# EAGLE design mugsyBrainBoard_p08 (EAGLE 9.6.2)
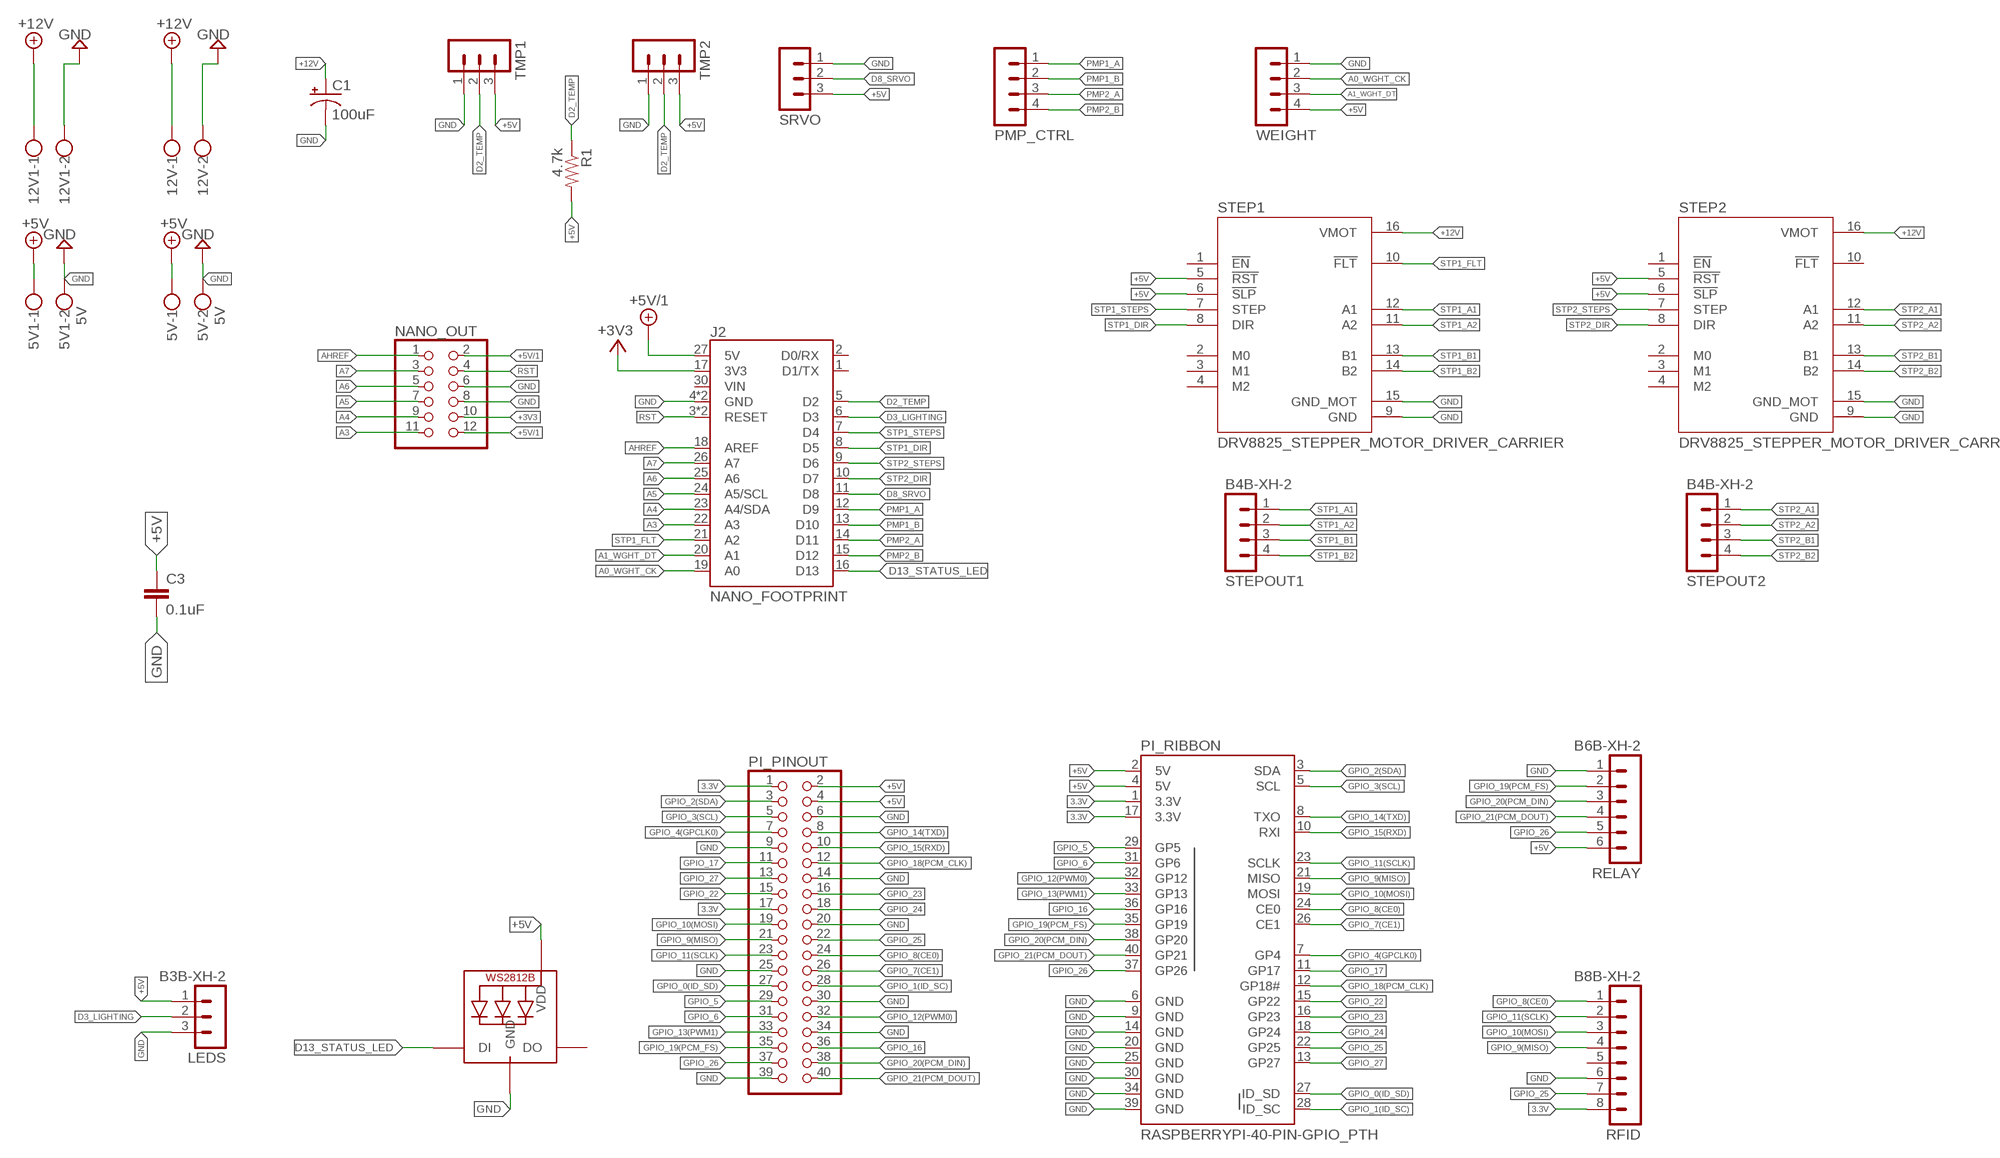
[diagram p0: schematic, sheet 1]

## Parts
5V  5V  W237-102  [W237-102]
5V1  5V  W237-102  [W237-102]
12V  W237-102  [W237-102]
12V1  W237-102  [W237-102]
C1  100uF  100UF-POLAR-RADIAL-2.5MM-25V-20%  [CPOL-RADIAL-2.5MM-6.5MM]
C3  0.1uF  C-EU050-030X075  [C050-030X075]
J2  NANO_FOOTPRINT  [NANO]
LEDS  B3B-XH-2  [B3B-XH-A]
NANO_OUT  PINHD-2X6  [2X06]
PI_PINOUT  PINHD-2X20  [2X20]
PI_RIBBON  RASPBERRYPI-40-PIN-GPIO_PTH  [2X20_SHROUDED]
PMP_CTRL  B4B-XH-2  [B4B-XH-A]
R1  4.7k  R-US_0207/5V  [0207/5V]
RELAY  B6B-XH-2  [B6B-XH-A]
RFID  B8B-XH-2  [B8B-XH-A]
SRVO  B3B-XH-2  [B3B-XH-A]
STATUS  WS2812B5050  [WS2812B]
STEP1  DRV8825_STEPPER_MOTOR_DRIVER_CARRIER  [IC_DRV8825_STEPPER_MOTOR_DRIVER_CARRIER]
STEP2  DRV8825_STEPPER_MOTOR_DRIVER_CARRIER  [IC_DRV8825_STEPPER_MOTOR_DRIVER_CARRIER]
STEPOUT1  B4B-XH-2  [B4B-XH-A]
STEPOUT2  B4B-XH-2  [B4B-XH-A]
TMP1  B3B-XH-2  [B3B-XH-A]
TMP2  B3B-XH-2  [B3B-XH-A]
WEIGHT  B4B-XH-2  [B4B-XH-A]

## Nets
3.3V [def2]: PI_PINOUT.1 PI_PINOUT.17 PI_RIBBON.1(3.3V) PI_RIBBON.17(3.3V) RFID.8
+3V3 [def2]: J2.17(3V3) NANO_OUT.10
+5V [5V]: 5V1.1 5V.1 C3.1 LEDS.1 PI_PINOUT.2 PI_PINOUT.4 PI_RIBBON.2(5V) PI_RIBBON.4(5V) R1.2 RELAY.6 SRVO.3 STATUS.1-VDD(VDD) STEP1.5(!RST) STEP1.6(!SLP) STEP2.5(!RST) STEP2.6(!SLP) TMP1.3 TMP2.3 WEIGHT.4
+5V/1 [def2]: J2.27(5V) NANO_OUT.2 NANO_OUT.12
+12V [12V]: 12V1.1 12V.1 C1.1(+) STEP1.16(VMOT) STEP2.16(VMOT)
A0_WGHT_CK [def2]: J2.19(A0) WEIGHT.2
A1_WGHT_DT [def2]: J2.20(A1) WEIGHT.3
A3 [def2]: J2.22(A3) NANO_OUT.11
A4 [def2]: J2.23(A4/SDA) NANO_OUT.9
A5 [def2]: J2.24(A5/SCL) NANO_OUT.7
A6 [def2]: J2.25(A6) NANO_OUT.5
A7 [def2]: J2.26(A7) NANO_OUT.3
AHREF [def2]: J2.18(AREF) NANO_OUT.1
D2_TEMP [def2]: J2.5(D2) R1.1 TMP1.2 TMP2.2
D3_LIGHTING [def2]: J2.6(D3) LEDS.2
D8_SRVO [def2]: J2.11(D8) SRVO.2
D13_STATUS_LED [def2]: J2.16(D13) STATUS.4-DIN(DI)
GND [def2]: 5V1.2 5V.2 12V1.2 12V.2 C1.2(-) C3.2 J2.4(GND) J2.29(GND) LEDS.3 NANO_OUT.6 NANO_OUT.8 PI_PINOUT.6 PI_PINOUT.9 PI_PINOUT.14 PI_PINOUT.20 PI_PINOUT.25 PI_PINOUT.30 PI_PINOUT.34 PI_PINOUT.39 PI_RIBBON.6(GND) PI_RIBBON.9(GND) PI_RIBBON.14(GND) PI_RIBBON.20(GND) PI_RIBBON.25(GND) PI_RIBBON.30(GND) PI_RIBBON.34(GND) PI_RIBBON.39(GND) RELAY.1 RFID.6 SRVO.1 STATUS.3-GND(GND) STEP1.9(GND) STEP1.15(GND_MOT) STEP2.9(GND) STEP2.15(GND_MOT) TMP1.1 TMP2.1 WEIGHT.1
GPIO_0(ID_SD) [def2]: PI_PINOUT.27 PI_RIBBON.27(ID_SD)
GPIO_1(ID_SC) [def2]: PI_PINOUT.28 PI_RIBBON.28(ID_SC)
GPIO_2(SDA) [def2]: PI_PINOUT.3 PI_RIBBON.3(SDA)
GPIO_3(SCL) [def2]: PI_PINOUT.5 PI_RIBBON.5(SCL)
GPIO_4(GPCLK0) [def2]: PI_PINOUT.7 PI_RIBBON.7(GP4)
GPIO_5 [def2]: PI_PINOUT.29 PI_RIBBON.29(GP5)
GPIO_6 [def2]: PI_PINOUT.31 PI_RIBBON.31(GP6)
GPIO_7(CE1) [def2]: PI_PINOUT.26 PI_RIBBON.26(CE1)
GPIO_8(CE0) [def2]: PI_PINOUT.24 PI_RIBBON.24(CE0) RFID.1
GPIO_9(MISO) [def2]: PI_PINOUT.21 PI_RIBBON.21(MISO) RFID.4
GPIO_10(MOSI) [def2]: PI_PINOUT.19 PI_RIBBON.19(MOSI) RFID.3
GPIO_11(SCLK) [def2]: PI_PINOUT.23 PI_RIBBON.23(SCLK) RFID.2
GPIO_12(PWM0) [def2]: PI_PINOUT.32 PI_RIBBON.32(GP12)
GPIO_13(PWM1) [def2]: PI_PINOUT.33 PI_RIBBON.33(GP13)
GPIO_14(TXD) [def2]: PI_PINOUT.8 PI_RIBBON.8(TXO)
GPIO_15(RXD) [def2]: PI_PINOUT.10 PI_RIBBON.10(RXI)
GPIO_16 [def2]: PI_PINOUT.36 PI_RIBBON.36(GP16)
GPIO_17 [def2]: PI_PINOUT.11 PI_RIBBON.11(GP17)
GPIO_18(PCM_CLK) [def2]: PI_PINOUT.12 PI_RIBBON.12(GP18#)
GPIO_19(PCM_FS) [def2]: PI_PINOUT.35 PI_RIBBON.35(GP19) RELAY.2
GPIO_20(PCM_DIN) [def2]: PI_PINOUT.38 PI_RIBBON.38(GP20) RELAY.3
GPIO_21(PCM_DOUT) [def2]: PI_PINOUT.40 PI_RIBBON.40(GP21) RELAY.4
GPIO_22 [def2]: PI_PINOUT.15 PI_RIBBON.15(GP22)
GPIO_23 [def2]: PI_PINOUT.16 PI_RIBBON.16(GP23)
GPIO_24 [def2]: PI_PINOUT.18 PI_RIBBON.18(GP24)
GPIO_25 [def2]: PI_PINOUT.22 PI_RIBBON.22(GP25) RFID.7
GPIO_26 [def2]: PI_PINOUT.37 PI_RIBBON.37(GP26) RELAY.5
GPIO_27 [def2]: PI_PINOUT.13 PI_RIBBON.13(GP27)
PMP1_A [def2]: J2.12(D9) PMP_CTRL.1
PMP1_B [def2]: J2.13(D10) PMP_CTRL.2
PMP2_A [def2]: J2.14(D11) PMP_CTRL.3
PMP2_B [def2]: J2.15(D12) PMP_CTRL.4
RST [def2]: J2.3(RESET) J2.28(RESET) NANO_OUT.4
STP1_A1 [def2]: STEP1.12(A1) STEPOUT1.1
STP1_A2 [def2]: STEP1.11(A2) STEPOUT1.2
STP1_B1 [def2]: STEP1.13(B1) STEPOUT1.3
STP1_B2 [def2]: STEP1.14(B2) STEPOUT1.4
STP1_DIR [def2]: J2.8(D5) STEP1.8(DIR)
STP1_FLT [def2]: J2.21(A2) STEP1.10(!FLT)
STP1_STEPS [def2]: J2.7(D4) STEP1.7(STEP)
STP2_A1 [def2]: STEP2.12(A1) STEPOUT2.1
STP2_A2 [def2]: STEP2.11(A2) STEPOUT2.2
STP2_B1 [def2]: STEP2.13(B1) STEPOUT2.3
STP2_B2 [def2]: STEP2.14(B2) STEPOUT2.4
STP2_DIR [def2]: J2.10(D7) STEP2.8(DIR)
STP2_STEPS [def2]: J2.9(D6) STEP2.7(STEP)
Unconnected: J2.1(D1/TX) J2.2(D0/RX) J2.30(VIN) RFID.5 STATUS.2-DOUT(DO) STEP1.1(!EN) STEP1.2(M0) STEP1.3(M1) STEP1.4(M2) STEP2.1(!EN) STEP2.2(M0) STEP2.3(M1) STEP2.4(M2) STEP2.10(!FLT)

## Library data of the parts
5V 5V1 12V 12V1 = con-wago-500:W237-102: WAGO SCREW CLAMP; MPN: 237-102; OC_FARNELL: unknown; OC_NEWARK: 70K9898
C1 = SparkFun-Capacitors:100UF-POLAR: 100µF polarized capacitors A capacitor is a passive two-terminal electrical component used to store electrical energy temporarily in an electric field.; PROD_ID: CAP-08439
C3 = rcl:C-EU: CAPACITOR, European symbol; SPICEPREFIX: C
J2 = SparkFun-Boards:NANO_FOOTPRINT: Generic Nano Footprint
LEDS SRVO TMP1 TMP2 = con-JST XH:B3B-XH: JST XH series header 2.50mm pitch disconnectable crimp style connectors, vertical (side entry type), 3 pins
NANO_OUT = pinhead:PINHD-2X6: PIN HEADER
PI_PINOUT = pinhead:PINHD-2X20: PIN HEADER
PI_RIBBON = SparkFun-Connectors:RASPBERRYPI-40-PIN-GPIO: Raspberry Pi GPIO Header 2x20 pin connector, as found on B, B+, A+ models. Both shrouded PTH and SMT versions available. SparkFun Products: GPIO Shrouded Header <https://www.sparkfun.com/products/13054>- PTH SparkFun Pi Wedge (Preassembled) <https://www.sparkfun.com/products/13717>; PROD_ID: CONN-12263; SF_ID: PRT-13054
PMP_CTRL STEPOUT1 STEPOUT2 WEIGHT = con-JST XH:B4B-XH: JST XH series header 2.50mm pitch disconnectable crimp style connectors, vertical (side entry type), 4 pins
R1 = resistor:R-US_: RESISTOR, American symbol
RELAY = con-JST XH:B6B-XH: JST XH series header 2.50mm pitch disconnectable crimp style connectors, vertical (side entry type), 6 pins
RFID = con-JST XH:B8B-XH: JST XH series header 2.50mm pitch disconnectable crimp style connectors, vertical (side entry type), 8 pins
STATUS = adafruit:WS2812B
STEP1 STEP2 = DRV8825_STEPPER_MOTOR_DRIVER_CARRIER:DRV8825_STEPPER_MOTOR_DRIVER_CARRIER: Stepper motor controler; IC: DRV8825; 1.5A; Uin mot: 8.2÷45V; AVAILABILITY: Unavailable; DESCRIPTION: Stepper, Bipolar 8.2 ~ 45VDC Supply 1.5A 8.2 ~ 45V Load; MF: Pololu; MP: DRV8825 STEPPER MOTOR DRIVER CARRIER; PACKAGE: None; PRICE: None

## Net classes
0 default: width 0.152 mm
1 5V: width 0.406 mm, drill 0.406 mm, clearance 0.254 mm
2 12V: width 0.457 mm, drill 0.457 mm, clearance 0.356 mm

## Board
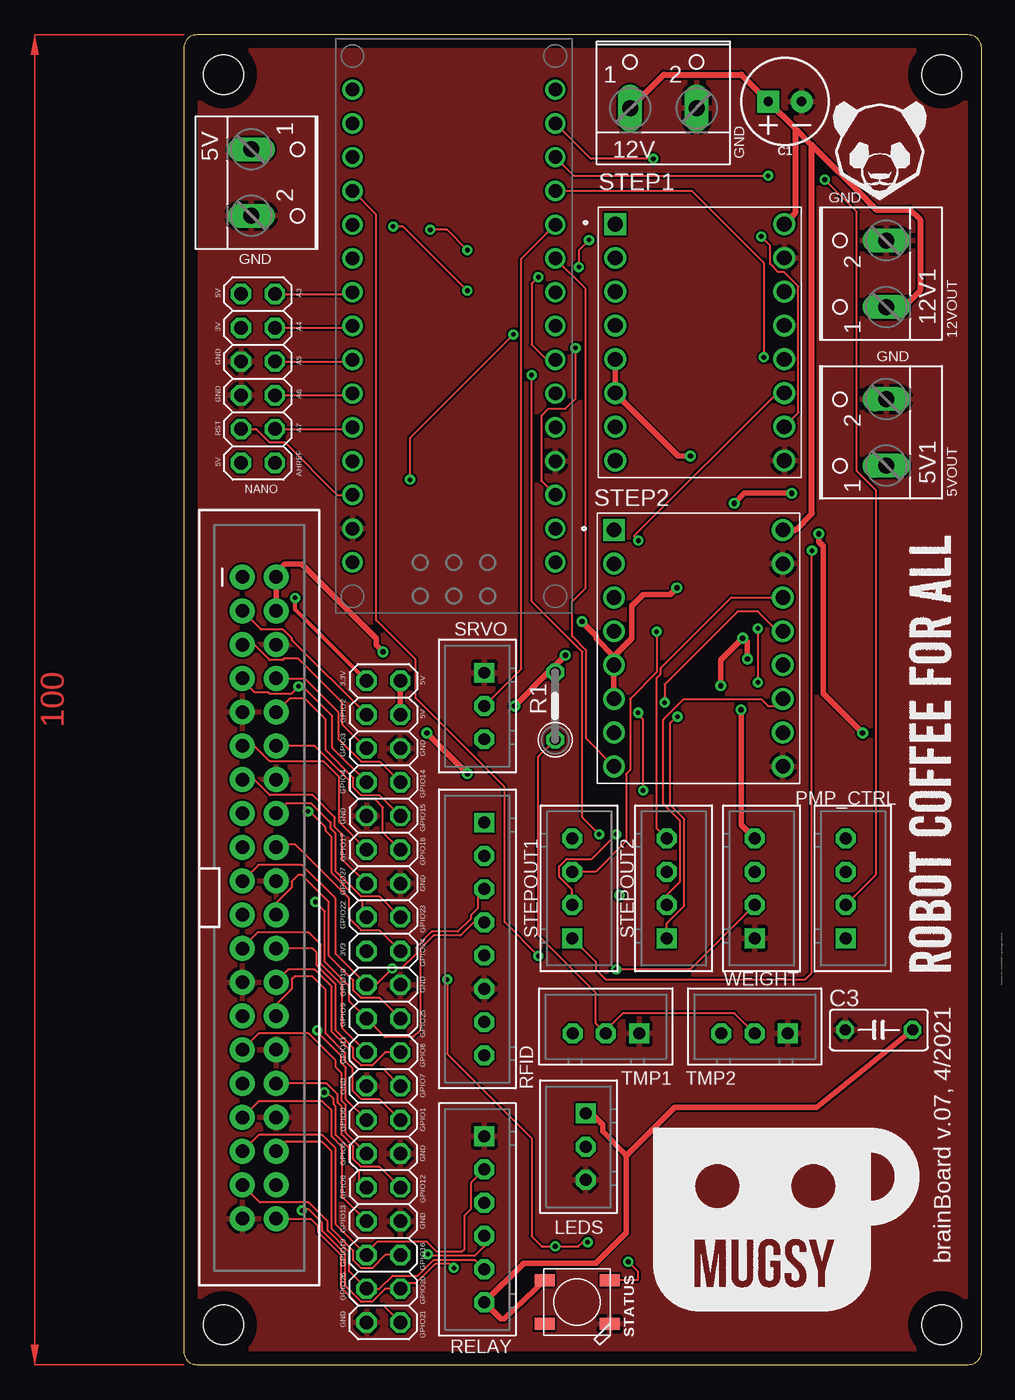
[diagram p1: board, top side]
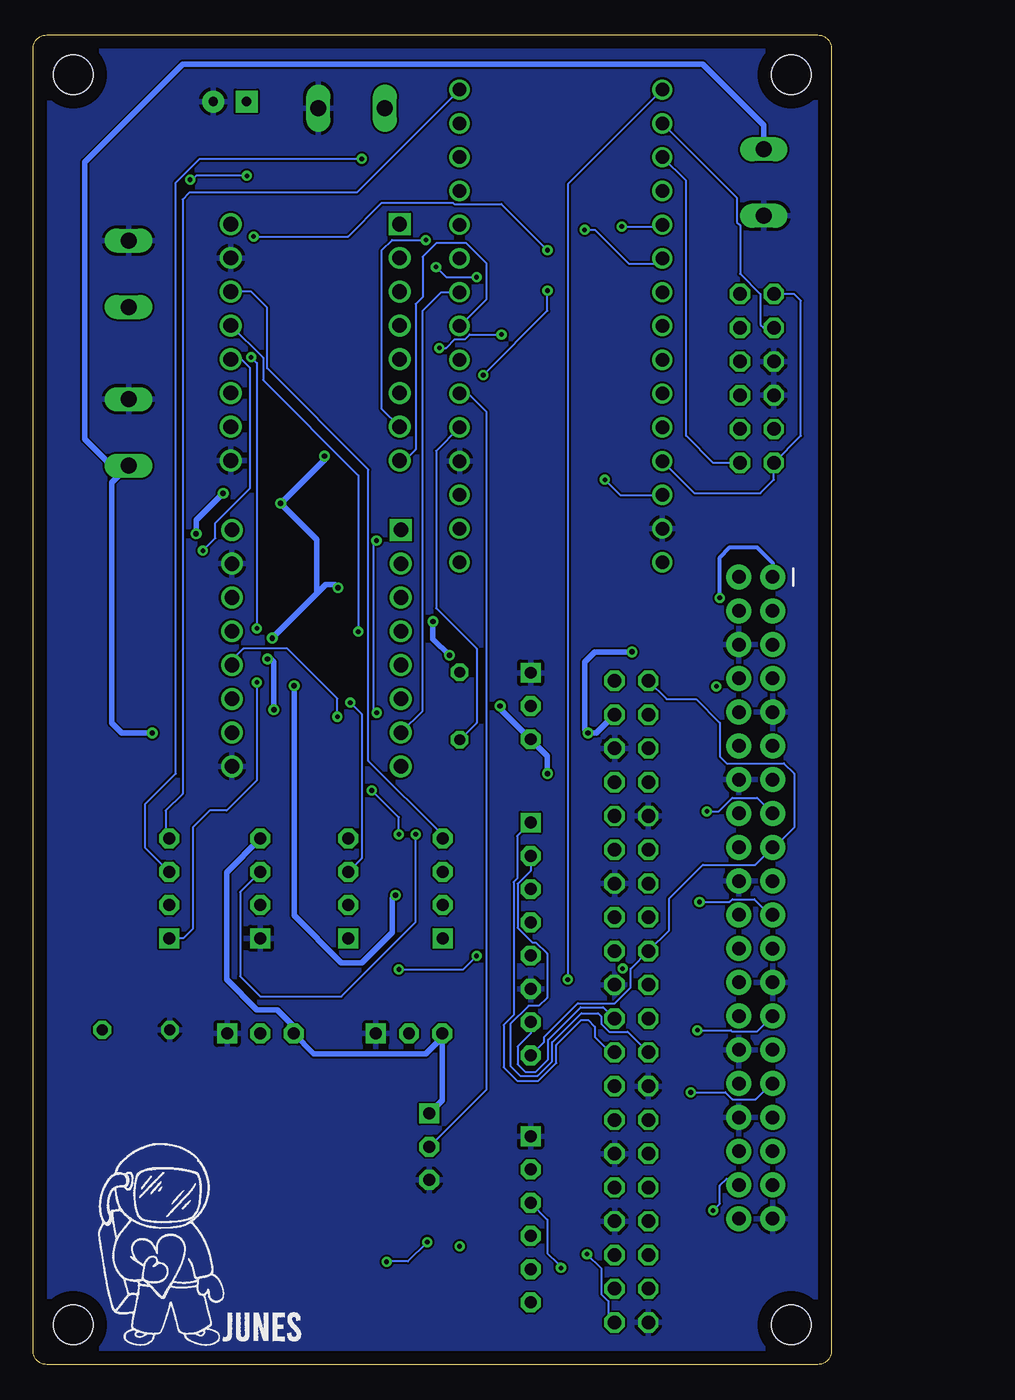
[diagram p2: board, bottom side, seen from below]

Size 60 x 100 mm. Coordinates in mm from the lower left corner, seen from the top.
Outline: 0,99 0,1 arc90 1,0 59,0 arc90 60,1 60,99 arc90 59,100 1,100 arc90 0,99
Copper layers (1*16): Top 0.035mm / dielectric 1.5mm / Bottom 0.035mm
Design rules "default": minimum track width 6mil, minimum drill 0.35mm, track to track 6mil, track to pad 6mil, pad to pad 6mil, via to via 6mil, smd to smd 6mil, copper to edge 40mil, drill to drill 6mil, minimum pad ring 10mil, minimum via ring 8mil, stop-mask expansion 4mil, vias tented up to drill 0mil, thermal gap 10mil
Holes 3 mm at 3,97 3,3 57,3 57,97

### Footprints (pad centres in the part's own frame; a part is rotated, then mirrored left to right if it is on the bottom)
W237-102 = drill 1.194 long: 1 -2.5,-1.27; 2 2.5,-1.27
CPOL-RADIAL-2.5MM-6.5MM = drill 0.7 pad 1.651 square: 1 1.25,0 | drill 0.7 pad 1.651: 2 -1.25,0
C050-030X075 = drill 0.813 octagon: 1 -2.54,0; 2 2.54,0
NANO = drill 1.016: 1 -7.62,17.78; 2 -7.62,15.24; 3 -7.62,12.7; 4 -7.62,10.16; 5 -7.62,7.62; 6 -7.62,5.08; 7 -7.62,2.54; 8 -7.62,0; 9 -7.62,-2.54; 10 -7.62,-5.08; 11 -7.62,-7.62; 12 -7.62,-10.16; 13 -7.62,-12.7; 14 -7.62,-15.24; 15 -7.62,-17.78; 16 7.62,-17.78; 17 7.62,-15.24; 18 7.62,-12.7; 19 7.62,-10.16; 20 7.62,-7.62; 21 7.62,-5.08; 22 7.62,-2.54; 23 7.62,0; 24 7.62,2.54; 25 7.62,5.08; 26 7.62,7.62; 27 7.62,10.16; 28 7.62,12.7; 29 7.62,15.24; 30 7.62,17.78
B3B-XH-A = drill 0.9 pad 1.5 square: 1 2.5,0 | drill 0.9 pad 1.5 octagon: 2 0,0; 3 -2.5,0
2X06 = drill 1.016 octagon: 1 -6.35,-1.27; 2 -6.35,1.27; 3 -3.81,-1.27; 4 -3.81,1.27; 5 -1.27,-1.27; 6 -1.27,1.27; 7 1.27,-1.27; 8 1.27,1.27; 9 3.81,-1.27; 10 3.81,1.27; 11 6.35,-1.27; 12 6.35,1.27
2X20 = drill 1.016 octagon: 1 -24.13,-1.27; 2 -24.13,1.27; 3 -21.59,-1.27; 4 -21.59,1.27; 5 -19.05,-1.27; 6 -19.05,1.27; 7 -16.51,-1.27; 8 -16.51,1.27; 9 -13.97,-1.27; 10 -13.97,1.27; 11 -11.43,-1.27; 12 -11.43,1.27; 13 -8.89,-1.27; 14 -8.89,1.27; 15 -6.35,-1.27; 16 -6.35,1.27; 17 -3.81,-1.27; 18 -3.81,1.27; 19 -1.27,-1.27; 20 -1.27,1.27; 21 1.27,-1.27; 22 1.27,1.27; 23 3.81,-1.27; 24 3.81,1.27; 25 6.35,-1.27; 26 6.35,1.27; 27 8.89,-1.27; 28 8.89,1.27; 29 11.43,-1.27; 30 11.43,1.27; 31 13.97,-1.27; 32 13.97,1.27; 33 16.51,-1.27; 34 16.51,1.27; 35 19.05,-1.27; 36 19.05,1.27; 37 21.59,-1.27; 38 21.59,1.27; 39 24.13,-1.27; 40 24.13,1.27
2X20_SHROUDED = drill 1.016 pad 1.88: 1 -1.27,24.13; 2 1.27,24.13; 3 -1.27,21.59; 4 1.27,21.59; 5 -1.27,19.05; 6 1.27,19.05; 7 -1.27,16.51; 8 1.27,16.51; 9 -1.27,13.97; 10 1.27,13.97; 11 -1.27,11.43; 12 1.27,11.43; 13 -1.27,8.89; 14 1.27,8.89; 15 -1.27,6.35; 16 1.27,6.35; 17 -1.27,3.81; 18 1.27,3.81; 19 -1.27,1.27; 20 1.27,1.27; 21 -1.27,-1.27; 22 1.27,-1.27; 23 -1.27,-3.81; 24 1.27,-3.81; 25 -1.27,-6.35; 26 1.27,-6.35; 27 -1.27,-8.89; 28 1.27,-8.89; 29 -1.27,-11.43; 30 1.27,-11.43; 31 -1.27,-13.97; 32 1.27,-13.97; 33 -1.27,-16.51; 34 1.27,-16.51; 35 -1.27,-19.05; 36 1.27,-19.05; 37 -1.27,-21.59; 38 1.27,-21.59; 39 -1.27,-24.13; 40 1.27,-24.13
B4B-XH-A = drill 0.9 pad 1.5 square: 1 3.75,0 | drill 0.9 pad 1.5 octagon: 2 1.25,0; 3 -1.25,0; 4 -3.75,0
0207/5V = drill 0.813 octagon: 1 -2.54,0; 2 2.54,0
B6B-XH-A = drill 0.9 pad 1.5 square: 1 6.25,0 | drill 0.9 pad 1.5 octagon: 2 3.75,0; 3 1.25,0; 4 -1.25,0; 5 -3.75,0; 6 -6.25,0
B8B-XH-A = drill 0.9 pad 1.5 square: 1 8.75,0 | drill 0.9 pad 1.5 octagon: 2 6.25,0; 3 3.75,0; 4 1.25,0; 5 -1.25,0; 6 -3.75,0; 7 -6.25,0; 8 -8.75,0
WS2812B = smd 1.5 x 0.9: 1-VDD 2.45,-1.65; 2-DOUT 2.45,1.65; 3-GND -2.45,1.65; 4-DIN -2.45,-1.65
IC_DRV8825_STEPPER_MOTOR_DRIVER_CARRIER = drill 1.1 square: 1 -6.35,8.89 | drill 1.1: 2 -6.35,6.35; 3 -6.35,3.81; 4 -6.35,1.27; 5 -6.35,-1.27; 6 -6.35,-3.81; 7 -6.35,-6.35; 8 -6.35,-8.89; 9 6.35,-8.89; 10 6.35,-6.35; 11 6.35,-3.81; 12 6.35,-1.27; 13 6.35,1.27; 14 6.35,3.81; 15 6.35,6.35; 16 6.35,8.89

### Placement (x,y rotation side)
5V  6.35,88.9 270 top
5V1  51.56,70.1 90 top
12V  36.07,95.76 0 top
12V1  51.56,82.04 90 top
C1  45.21,95 180 top
C3  52.27,25.17 180 top
J2  20.32,78.11 180 top
LEDS  30.23,16.38 90 top
NANO_OUT  5.59,74.17 90 top
PI_PINOUT  15.02,27.29 270 top
PI_RIBBON  5.69,35.1 0 top
PMP_CTRL  49.78,35.81 270 top
R1  27.94,49.53 90 top
RELAY  22.61,10.92 90 top
RFID  22.61,32 90 top
SRVO  22.61,49.53 90 top
STATUS  29.59,4.7 180 top
STEP1  38.8,76.88 0 top
STEP2  38.71,53.88 0 top
STEPOUT1  29.21,35.81 270 top
STEPOUT2  36.32,35.81 270 top
TMP1  31.75,24.89 0 top
TMP2  42.93,24.89 0 top
WEIGHT  42.93,35.81 270 top

### Tracks (layer width: path | path; a pad name or v marks a point on that pad's centre or on a via)
3.3V  (via drill 0.35)
  Top 0.305: PI_PINOUT.1 8.38,56.79 v8.38,57.66
  Bottom 0.152: RFID.8 21.59,24.27 21.59,24.64 19.05,27.18 16.27,27.18 15.08,28.37 15.08,29.77 PI_PINOUT.17 12.19,32.66 12.19,35.05 9.65,37.59 5.73,37.59 PI_RIBBON.17 4.27,38.91 2.79,40.39 2.79,44.45 3.56,45.21 7.87,45.21 8.38,45.72 8.38,48.26 10.16,50.04 12.37,50.04 PI_PINOUT.1
  Bottom 0.305: v8.38,57.66 8.38,60.71 7.62,61.47 5.59,61.47 4.42,60.3 PI_RIBBON.1
+3V3
  Bottom 0.152: J2.17 7.1,87.74 7.1,85.93 6.86,85.69 6.86,82.04 5.33,80.52 5.33,78.23 5.08,77.98 NANO_OUT.10
+5V  (via drill 0.41)
  Top 0.406: STATUS.1-VDD 24.09,3.44 23.84,3.44 RELAY.6 25.55,7.62 30.99,7.62 33.27,9.91 33.27,15.69 | LEDS.1 30.65,18.88 31.5,18.03 31.5,17.53 33.27,15.75 33.27,15.69 | v24.89,49.53 27.43,52.07 R1.2 27.94,52.58 v28.7,53.34 | WEIGHT.4 41.91,40.58 v41.91,49.25 | v42.39,53.06 42.39,54.38 42.14,54.64 v42.03,54.64 40.39,52.99 v40.39,51.05 | 32.36,53.27 33.69,54.6 33.69,57.06 34.54,57.91 36.58,57.91 v37.08,58.42 | STEP2.6 STEP2.5 32.36,53.27 | v29.95,55.88 31.02,54.8 31.02,54.6 32.36,53.27 | v18.29,47.5 v21.34,44.45 | v41.4,64.77 42.16,65.53 v45.72,65.53 | STEP1.5 STEP1.6 37.2,68.33 v38.1,68.33 | v47.75,62.48 47.75,61.89 48.08,61.56 48.08,50.47 v51.05,47.5 | PI_RIBBON.4 PI_RIBBON.2 6.96,59.53 7.62,60.2 8.89,60.2 14.48,54.61 14.48,54.1 v14.99,53.59 | PI_PINOUT.2 PI_PINOUT.4 | C3.1 47.61,19.33 36.91,19.33 33.27,15.69
  Bottom 0.406: v24.89,49.53 24.89,49.32 SRVO.3 21.34,45.76 v21.34,44.45 | v41.91,49.25 41.91,52.83 42.16,53.09 42.37,53.09 v42.39,53.06 | v28.7,53.34 29.95,54.59 v29.95,55.88 | 5V.1 5.08,93.22 9.65,97.79 48.77,97.79 56.13,90.42 56.13,69.6 54.4,67.86 53.09,67.86 5V1.1 54.1,66.33 54.1,48.26 53.34,47.5 v51.05,47.5 | v42.03,54.64 38.68,57.99 | 38.68,57.99 37.99,58.67 37.34,58.67 v37.08,58.42 | LEDS.1 29.25,19.85 TMP1.3 29.25,24.6 30.48,23.37 38.9,23.37 TMP2.3 40.43,25.44 41.66,26.67 43.18,26.67 45.47,28.96 45.47,37.02 WEIGHT.4 | v40.39,51.05 40.39,33.78 36.83,30.23 35.31,30.23 33.02,32.51 33.02,35.05 v32.77,35.31 | PI_PINOUT.4 17.68,47.5 v18.29,47.5 18.54,47.75 18.54,52.83 17.78,53.59 v14.99,53.59 | 38.68,57.99 38.68,62.05 v41.4,64.77 38.1,68.07 v38.1,68.33 | v45.72,65.53 47.75,63.5 v47.75,62.48
+5V/1
  Bottom 0.152: J2.27 10.29,65.53 5.33,65.53 4.32,66.55 NANO_OUT.2 2.29,69.85 2.29,80.01 2.79,80.52 NANO_OUT.12
+12V
  Top 0.457: 45.98,92.97 47.24,91.71 | 47.24,91.71 51.31,87.65 51.31,87.63 52.07,86.87 54.61,86.87 55.37,86.11 55.37,80.77 54.14,79.54 12V1.1 | 12V.1 36.11,97.03 41.93,97.03 C1.1 45.98,92.97 | STEP2.16 46.01,62.77 47.24,64.01 47.24,91.71 | 45.98,92.97 45.98,86.6 STEP1.16
A0_WGHT_CK  (via drill 0.35)
  Top 0.152: WEIGHT.2 38.08,29.72 v32.51,29.72 | v26.67,30.73 24.13,33.27 24.13,43.43 17.44,50.13 17.44,53.02 14.48,55.98 14.48,86.5 J2.19
  Bottom 0.152: v32.51,29.72 27.69,29.72 v26.67,30.73
A1_WGHT_DT  (via drill 0.35)
  Top 0.152: v31.24,39.88 29.97,41.15 29.97,53.59 26.16,57.4 v26.16,74.42 | v21.34,80.77 16.51,85.6 v15.75,85.6
  Bottom 0.152: WEIGHT.3 44.45,35.54 44.45,29.21 42.93,27.69 36.83,27.69 31.24,33.27 v31.24,39.88 | v26.16,74.42 21.34,79.25 v21.34,80.77 | v15.75,85.6 12.84,85.6 J2.20
A3
  Top 0.152: NANO_OUT.11 12.57,80.52 J2.22
A4
  Top 0.152: NANO_OUT.9 12.57,77.98 J2.23
A5
  Top 0.152: NANO_OUT.7 12.57,75.44 J2.24
A6
  Top 0.152: NANO_OUT.5 12.57,72.9 J2.25
A7
  Top 0.152: NANO_OUT.3 12.57,70.36 J2.26
AHREF
  Bottom 0.152: NANO_OUT.1 8.89,67.82 10.92,69.85 10.92,89.03 J2.18
D2_TEMP
  Top 0.152: TMP2.2 41.4,26.42 33.02,26.42 31.75,25.15 TMP1.2 30.99,25.65 30.99,27.94 26.67,32.26 26.67,45.72 R1.1
  Bottom 0.152: J2.5 29.72,68.72 29.72,56.9 26.67,53.85 26.67,48.26 R1.1
D3_LIGHTING
  Bottom 0.152: LEDS.2 25.91,20.7 25.91,71.63 27.31,73.03 J2.6
D8_SRVO
  Top 0.152: SRVO.2 25.4,52.32 25.4,83.19 J2.11
D13_STATUS_LED  (via drill 0.35)
  Top 0.152: v19.81,28.96 19.81,23.37 26.16,17.02 26.16,9.65 26.92,8.89 v27.94,8.89 29.68,8.89 29.99,9.21 v30.37,9.21 | STATUS.4-DIN 34.13,6.35 34.13,7.03 v33.43,7.73
  Bottom 0.152: J2.16 19.81,88.78 v19.81,28.96 | v30.37,9.21 31.83,7.75 33.41,7.75 v33.43,7.73
GND
  pour Top: 0.25,1.02 0.25,99.06 0.76,99.57 59.18,99.57 59.44,99.31 59.44,0.76 59.18,0.51 0.76,0.51
  pour Bottom: 0.51,1.02 0.51,98.81 1.27,99.57 58.67,99.57 58.93,99.31 58.93,2.03 57.91,1.02
GPIO_0(ID_SD)  (via drill 0.35)
  Top 0.152: PI_PINOUT.27 12.19,19.96 12.19,22.35 11.85,22.69 11.85,23.2 10.16,24.89 10.16,25.15 v10.06,25.15
  Bottom 0.152: v10.06,25.15 7.54,25.15 7.44,25.04 5.58,25.04 PI_RIBBON.27
GPIO_1(ID_SC)
  Top 0.152: PI_PINOUT.28 14.74,19.95 13.34,19.95 12.7,20.59 12.7,22.27 12.15,22.82 12.15,23.41 10.67,24.89 10.67,28.19 9.65,29.21 8.38,29.21 8.12,28.95 8.12,28.27 6.96,27.1 PI_RIBBON.28
GPIO_2(SDA)
  Top 0.152: PI_RIBBON.3 5.79,55.32 7.44,55.32 8.12,54.63 8.12,54.51 PI_PINOUT.3
GPIO_3(SCL)
  Top 0.152: PI_PINOUT.5 11.94,48.16 11.94,49.78 8.64,53.09 7.54,53.09 7.44,52.98 6.47,52.98 5.3,54.15 PI_RIBBON.5
GPIO_4(GPCLK0)  (via drill 0.35)
  Top 0.152: PI_PINOUT.7 11.18,46.38 11.18,48.77 8.89,51.05 8.64,51.05 v8.64,51 8.07,50.44 6.47,50.44 6.37,50.55 5.33,50.55 4.42,51.46 PI_RIBBON.7
GPIO_5
  Top 0.152: PI_PINOUT.29 12.19,17.42 12.19,19.53 11.89,19.84 11.89,21.89 11.43,22.35 11.43,22.86 9.4,24.89 5.64,24.89 PI_RIBBON.29
GPIO_6  (via drill 0.35)
  Top 0.152: PI_PINOUT.31 13.21,13.87 13.21,14.57 12.46,15.32 12.46,16.24 11.43,17.27 11.43,19.43 11.28,19.58 11.28,19.96 10.77,20.47 v10.57,20.47
  Bottom 0.152: v10.57,20.47 7.95,20.47 7.44,19.96 5.69,19.96 4.52,21.13 PI_RIBBON.31
GPIO_7(CE1)
  Top 0.152: PI_PINOUT.26 15.05,22.18 13.22,22.18 12.46,22.94 12.46,23.69 11.12,25.02 11.12,28.45 9.85,29.72 7.87,29.72 6.96,28.8 PI_RIBBON.26
GPIO_8(CE0)
  Top 0.152: PI_PINOUT.24 15.15,23.48 14.16,22.49 13.34,22.49 12.76,23.07 12.76,23.81 11.43,25.15 11.43,28.6 10.01,30.02 10.01,30.99 9.71,31.29 PI_RIBBON.24
  Bottom 0.152: RFID.1 23.62,39.74 23.62,36.55 23.89,36.29 23.89,26.29 24.64,25.54 24.64,22.35 23.62,21.34 22.02,21.34 20.68,22.68 20.68,24.03 18.8,25.91 18.29,25.91 17.78,25.4 17.78,24.64 16.62,23.48 PI_PINOUT.24
GPIO_9(MISO)  (via drill 0.35)
  Top 0.152: v9.91,34.8 10.62,34.09 10.62,30.28 12.45,28.45 12.45,27.33 PI_PINOUT.21 15.14,24.64 17.27,24.64 17.78,25.15 17.78,31.24 18.8,32.26 20.83,32.26 21.82,33.25 RFID.4
  Bottom 0.152: v9.91,34.8 7.64,34.8 7.44,35 5.79,35 4.62,33.83 PI_RIBBON.21
GPIO_10(MOSI)  (via drill 0.35)
  Top 0.152: PI_PINOUT.19 13.66,28.65 | 13.66,28.65 11.43,30.88 11.43,35.05 8.89,37.59 5.64,37.59 PI_RIBBON.19 | RFID.3 22.1,35.25 22.1,34.29 21.59,33.78 21.59,33.53 20.62,32.56 18.67,32.56 17.47,31.37 17.47,30.88 16.38,29.78 v15.69,29.78 14.56,28.65 13.66,28.65
GPIO_11(SCLK)
  Top 0.152: PI_PINOUT.23 11.94,25.3 11.94,28.52 10.31,30.15 10.31,31.6 9.4,32.51 5.59,32.51 4.42,31.34 PI_RIBBON.23
  Bottom 0.152: RFID.2 22.61,37.14 23.59,36.16 23.59,32.85 22.47,31.73 22.2,31.73 21.37,30.9 21.37,27.59 21.98,26.99 22.76,26.99 24.13,25.61 24.13,22.45 23.39,21.72 22.07,21.72 20.98,22.81 20.98,24.23 18.8,26.42 17.53,26.42 17.29,26.18 17.29,25.61 16.7,25.03 15.3,25.03 PI_PINOUT.23
GPIO_12(PWM0)
  Top 0.152: PI_PINOUT.32 14.74,14.87 13.34,14.87 12.76,15.45 12.76,16.42 11.89,17.3 11.89,19.4 11.58,19.71 11.58,20.32 10.77,21.13 PI_RIBBON.32
GPIO_13(PWM1)
  Top 0.152: PI_PINOUT.33 11.94,12.6 11.94,16.33 11.12,17.15 11.12,19.1 10.41,19.81 5.64,19.81 PI_RIBBON.33
GPIO_14(TXD)
  Top 0.152: PI_RIBBON.8 9.1,51.61 11.63,49.07 11.63,47.06 13.34,45.35 14.74,45.35 PI_PINOUT.8
GPIO_15(RXD)
  Top 0.152: PI_PINOUT.10 14.74,42.81 13.34,42.81 12.76,43.39 12.76,44.13 10.67,46.23 10.67,48.51 9.1,50.09 7.97,50.09 PI_RIBBON.10
GPIO_16
  Top 0.152: PI_PINOUT.36 15.15,8.24 14.16,7.25 13.34,7.25 12.76,7.83 12.76,8.57 11.12,10.21 11.12,16.05 10.41,16.76 7.67,16.76 PI_RIBBON.36
GPIO_17
  Top 0.152: PI_PINOUT.11 11.68,40.79 11.68,44.2 10.52,45.36 6.47,45.36 5.3,46.53 PI_RIBBON.11
GPIO_18(PCM_CLK)
  Top 0.152: PI_PINOUT.12 14.99,40.03 14.99,41.91 14.39,42.51 13.22,42.51 12.46,43.26 12.46,43.93 9.86,46.53 PI_RIBBON.12
GPIO_19(PCM_FS)
  Top 0.152: PI_PINOUT.35 13.66,8.33 | 13.66,8.33 11.43,10.56 11.43,16.26 10.41,17.27 5.64,17.27 PI_RIBBON.35 | RELAY.2 21.59,13.66 21.59,11.68 21.08,11.18 21.08,8.64 20.93,8.48 19.04,8.48 18.3,9.23 14.56,9.23 13.66,8.33
GPIO_20(PCM_DIN)  (via drill 0.35)
  Top 0.152: v8.89,11.58 8.89,11.68 9.4,11.68 10.41,10.67 10.41,10.06 12.14,8.33 12.14,5.91 13.34,4.71 14.16,4.71 15.15,5.7 PI_PINOUT.38 16.69,6.1 17.45,6.1 18.92,7.57 20.02,7.57 v20.32,7.27
  Bottom 0.152: v8.89,11.58 8.38,12.09 8.38,13.46 7.87,13.97 7.42,13.97 PI_RIBBON.38 | RELAY.3 21.34,10.9 21.34,8.38 20.57,7.62 20.32,7.62 v20.32,7.27
GPIO_21(PCM_DOUT)  (via drill 0.35)
  Top 0.152: PI_PINOUT.40 15.05,4.41 13.22,4.41 11.84,5.79 11.84,8.21 10.11,9.93 10.11,10.41 9.6,10.92 7,10.92 PI_RIBBON.40 | RELAY.4 22.61,8.89 21.89,8.18 18.59,8.18 18.54,8.13 v18.37,8.3
  Bottom 0.152: v18.37,8.3 17.29,7.22 17.29,5.29 16.76,4.77 16.76,3.63 PI_PINOUT.40
GPIO_22  (via drill 0.35)
  Top 0.152: PI_PINOUT.15 13.46,33.93 13.46,34.8 13.38,34.89 13.22,34.89 11.12,36.98 11.12,39.68 10.67,40.13 10.67,40.39 9.4,41.66 v9.35,41.61
  Bottom 0.152: v9.35,41.61 8.45,41.61 7.44,42.62 5.58,42.62 PI_RIBBON.15
GPIO_23
  Top 0.152: PI_PINOUT.16 14.74,35.19 13.34,35.19 11.43,37.1 11.43,39.96 11.07,40.31 11.07,40.74 9.6,42.21 7.72,42.21 PI_RIBBON.16
GPIO_24
  Top 0.152: PI_PINOUT.18 14.74,32.65 13.34,32.65 12.45,33.55 12.45,35.05 8.38,39.12 7.16,39.12 PI_RIBBON.18
GPIO_25
  Top 0.152: PI_PINOUT.22 14.74,27.57 13.34,27.57 12.76,28.15 12.76,28.89 10.92,30.73 10.92,34.8 8.89,36.83 8.64,36.83 8.12,36.32 8.12,35.89 6.96,34.72 PI_RIBBON.22
  Bottom 0.152: RFID.7 22.61,24.89 23.59,23.91 23.59,22.59 23.01,22.02 22.2,22.02 21.29,22.94 21.29,24.43 18.85,26.87 17.15,26.87 PI_PINOUT.22
GPIO_26
  Top 0.152: PI_RIBBON.37 5.73,12.19 9.4,12.19 10.82,10.77 10.82,10.08 12.45,8.46 12.45,7.01 PI_PINOUT.37 14.72,5.7 15.71,6.69 17.61,6.69 18.8,7.87 21.9,7.87 RELAY.5
GPIO_27
  Top 0.152: PI_PINOUT.13 11.94,38 11.94,39.88 11.38,40.44 11.38,41.15 9.71,42.82 6.47,42.82 5.3,43.99 PI_RIBBON.13
PMP1_A  (via drill 0.35)
  Top 0.152: J2.12 38.22,88.27 43.62,82.87 v43.62,75.76 | v43.18,55.37 v43.18,51.31
  Bottom 0.152: v43.62,75.76 43.18,75.32 v43.18,55.37 | v43.18,51.31 43.18,43.94 45.47,41.66 46.74,41.66 48.01,40.39 48.01,32.77 48.71,32.06 PMP_CTRL.1
PMP1_B  (via drill 0.35)
  Top 0.152: J2.13 29.35,89.41 v43.94,89.41 | PMP_CTRL.2 52.07,36.85 52.07,65.74 50.61,67.2 50.61,86.71 v48.21,89.11
  Bottom 0.152: v43.94,89.41 47.75,89.41 48.05,89.11 v48.21,89.11
PMP2_A  (via drill 0.35)
  Top 0.152: v35.31,90.68 30.62,90.68 J2.14
  Bottom 0.152: PMP_CTRL.3 51.56,38.84 51.56,42.16 49.28,44.45 49.28,88.9 47.5,90.68 v35.31,90.68
PMP2_B
  Bottom 0.152: J2.15 35.7,88.14 48.26,88.14 48.77,87.63 48.77,42.93 50.04,41.66 50.04,39.82 PMP_CTRL.4
RST  (via drill 0.35)
  Top 0.152: NANO_OUT.4 5.46,70.36 6.45,69.37 7.6,69.37 11.55,65.41 J2.28 | J2.3 26.92,66.43 26.92,71.37 27.43,71.88 28.7,71.88 29.46,72.64 v29.46,76.45 | v24.79,77.47 17.02,69.69 v17.02,66.55
  Bottom 0.152: v29.46,76.45 28.96,76.45 28.29,77.12 27.53,77.12 27.18,77.47 v24.79,77.47 | v17.02,66.55 15.88,65.41 J2.28
STP1_A1  (via drill 0.35)
  Top 0.152: STEPOUT1.1 30.99,30.29 30.99,29.72 31.75,28.96 46.74,28.96 47.24,29.46 v47.24,61.21
  Bottom 0.152: v47.24,61.21 46.32,62.14 46.32,63.29 43.69,65.92 43.69,74.93 44.37,75.61 STEP1.12
STP1_A2  (via drill 0.35)
  Top 0.152: STEPOUT1.2 29.21,35.68 28.23,36.66 28.23,37.47 28.8,38.04 30.68,38.04 v32.51,39.88 | v34.54,43.18 34.54,48.51 34.04,49.02 v34.17,49.02 | v34.19,61.98 33.86,62.31 44.7,73.15 45.07,73.15 STEP1.11
  Bottom 0.152: v32.51,39.88 32.51,41.15 v34.54,43.18 | v34.19,61.98 34.43,61.74 34.43,49.28 v34.17,49.02
STP1_B1  (via drill 0.35)
  Top 0.152: v35.56,55.12 35.56,52.07 33.56,50.07 33.56,44.71 33.27,44.42 33.27,39.37 30.97,37.06 STEPOUT1.3
  Bottom 0.152: STEP1.13 42.72,75.72 42.72,74.04 35.56,66.88 v35.56,55.12
STP1_B2
  Bottom 0.152: STEPOUT1.4 29.21,39.82 34.8,45.41 34.8,67.31 42.42,74.93 42.42,79.5 43.61,80.69 STEP1.14
STP1_DIR
  Bottom 0.152: J2.8 25.91,80.15 25.91,82.8 27.43,84.33 29.72,84.33 30.73,83.31 30.73,80.26 31.24,79.76 31.24,68.83 32.08,67.99 STEP1.8
STP1_FLT  (via drill 0.35)
  Top 0.152: STEP1.10 46.23,71.61 46.23,81.11 45.16,82.18 44.72,82.18 44.1,82.8 44.1,84.17 v43.43,84.84 | v21.34,83.82 19.81,85.34 v18.54,85.34
  Bottom 0.152: v43.43,84.84 36.32,84.84 33.78,87.38 28.45,87.38 28.35,87.28 24.79,87.28 v21.34,83.82 | v18.54,85.34 17.78,85.34 15.24,82.8 13.09,82.8 J2.21
STP1_STEPS  (via drill 0.35)
  Top 0.152: v30.48,84.58 29.72,83.82 v29.72,82.55 | v26.67,81.79 26.16,81.28 26.16,76.71 27.3,75.57 J2.7
  Bottom 0.152: STEP1.7 33.78,71.86 33.78,83.82 33.02,84.58 v30.48,84.58 | v29.72,82.55 28.96,81.79 v26.67,81.79
STP2_A1  (via drill 0.35)
  Top 0.152: STEPOUT2.1 36.32,33.18 37.64,34.5 37.64,41.02 36.58,42.09 36.58,48.26 37.04,48.72 v37.13,48.72
  Bottom 0.152: v37.13,48.72 37.13,50.09 40.89,53.85 44.2,53.85 45.06,52.99 STEP2.12
STP2_A2
  Top 0.152: STEPOUT2.2 36.32,35.31 37.34,36.32 37.34,40.89 36.07,42.16 36.07,48.51 37.59,50.04 43.43,50.04 43.94,49.53 44.52,49.53 STEP2.11
STP2_B1  (via drill 0.35)
  Top 0.152: STEP2.13 44.67,55.15 43.18,56.64 41.66,56.64 36.17,51.15 v36.17,49.78
  Bottom 0.152: v36.17,49.78 35.31,48.92 35.31,38.08 STEPOUT2.3
STP2_B2
  Top 0.152: STEPOUT2.4 35.56,40.33 35.56,51.64 35.87,51.94 35.87,52.38 41.18,57.69 STEP2.14
STP2_DIR
  Top 0.152: STEP2.8 30.28,47.07 30.28,53.72 29.21,54.79 29.21,57.4 30.23,58.42 30.23,80.91 J2.10
STP2_STEPS
  Bottom 0.152: STEP2.7 30.73,49.15 30.73,79.25 29.33,80.65 J2.9
(copper drawn outside any net)
  shapes: Top area x1

### Text on the board
tPlace: GND | GND | GND | 5V | A3 | 3V | A4 | 12VOUT | GND | A5 | GND | A6 | GND | RST | A7 | 5V | AHREF | NANO | 5VOUT | 5V | 3.3V | 5V | GPIO2 | GND | GPIO3 | GPIO14 | GPIO4 | GPIO15 | GND | GPIO18 | GPIO17 | GND | GPIO27 | GPIO23 | GPIO22 | GPIO24 | 3V3 | GND | /Users/maos/Documents/EAGLE/projects/mugsy_01/rcfa.bmp | GPIO10 | GPIO25 | GPIO9 | GPIO8 | GPIO11 | GPIO7 | GND | GPIO1 | GPIO0 | GND | GPIO5 | GPIO12 | GPIO6 | GND | GPIO13 | GPIO16 | GPIO19 | GPIO20 | GPIO26 | GPIO21 | GND
tNames: brainBoard v.07, 4/2021